# EAGLE schematic leer2 (EAGLE 6.5.0)
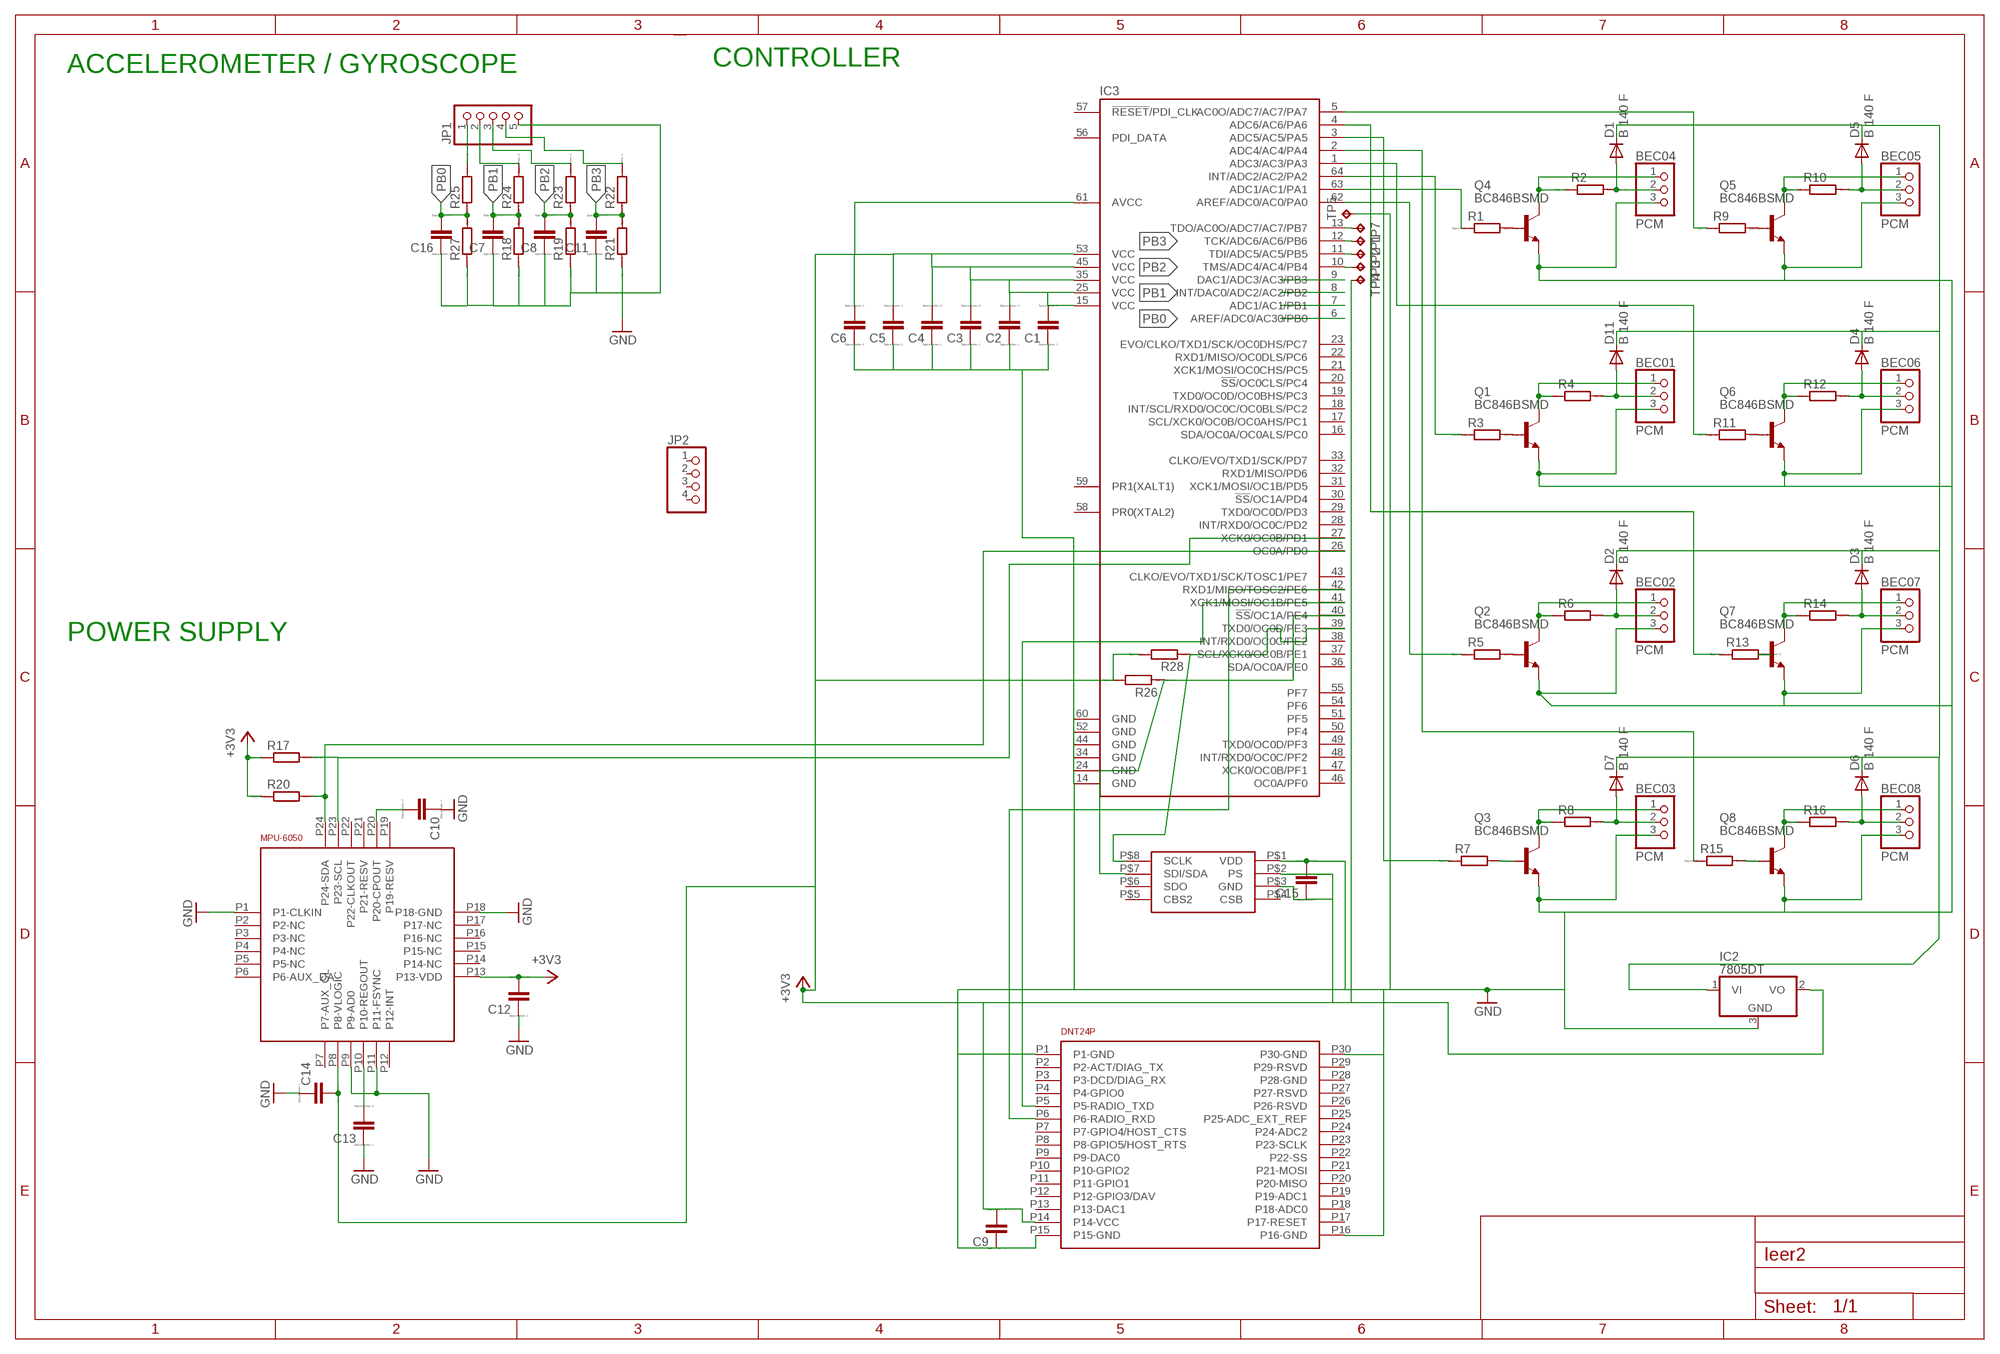
[diagram p0: schematic, sheet 1]

## Parts
BEC01  PCM  PINHD-1X3  [1X03]
BEC02  PCM  PINHD-1X3  [1X03]
BEC03  PCM  PINHD-1X3  [1X03]
BEC04  PCM  PINHD-1X3  [1X03]
BEC05  PCM  PINHD-1X3  [1X03]
BEC06  PCM  PINHD-1X3  [1X03]
BEC07  PCM  PINHD-1X3  [1X03]
BEC08  PCM  PINHD-1X3  [1X03]
C1  CC0603  [C0603]
C2  CC0603  [C0603]
C3  CC0603  [C0603]
C4  CC0603  [C0603]
C5  CC0603  [C0603]
C6  CC0603  [C0603]
C7  CC0603  [C0603]
C8  CC0603  [C0603]
C9  CC0603  [C0603]
C10  CC0603  [C0603]
C11  CC0603  [C0603]
C12  CC0603  [C0603]
C13  CC0603  [C0603]
C14  CC0603  [C0603]
C15  CC0603  [C0603]
C16  CC0603  [C0603]
D1  B 140 F  CGRM4001-G  [SOD-123_MINI-SMA]
D2  B 140 F  CGRM4001-G  [SOD-123_MINI-SMA]
D3  B 140 F  CGRM4001-G  [SOD-123_MINI-SMA]
D4  B 140 F  CGRM4001-G  [SOD-123_MINI-SMA]
D5  B 140 F  CGRM4001-G  [SOD-123_MINI-SMA]
D6  B 140 F  CGRM4001-G  [SOD-123_MINI-SMA]
D7  B 140 F  CGRM4001-G  [SOD-123_MINI-SMA]
D11  B 140 F  CGRM4001-G  [SOD-123_MINI-SMA]
IC2  7805DT  [TO252]
IC3  ATXMEGA##A3-64A  [TQFP-64]
JP1  PINHD-1X5/90  [1X05/90]
JP2  PINHD-1X4/90  [1X04/90]
Q1  BC846BSMD  [SOT23]
Q2  BC846BSMD  [SOT23]
Q3  BC846BSMD  [SOT23]
Q4  BC846BSMD  [SOT23]
Q5  BC846BSMD  [SOT23]
Q6  BC846BSMD  [SOT23]
Q7  BC846BSMD  [SOT23]
Q8  BC846BSMD  [SOT23]
R1  RR0603  [R0603]
R2  RR0603  [R0603]
R3  RR0603  [R0603]
R4  RR0603  [R0603]
R5  RR0603  [R0603]
R6  RR0603  [R0603]
R7  RR0603  [R0603]
R8  RR0603  [R0603]
R9  RR0603  [R0603]
R10  RR0603  [R0603]
R11  RR0603  [R0603]
R12  RR0603  [R0603]
R13  RR0603  [R0603]
R14  RR0603  [R0603]
R15  RR0603  [R0603]
R16  RR0603  [R0603]
R17  RR0603  [R0603]
R18  RR0603  [R0603]
R19  RR0603  [R0603]
R20  RR0603  [R0603]
R21  RR0603  [R0603]
R22  RR0603  [R0603]
R23  RR0603  [R0603]
R24  RR0603  [R0603]
R25  RR0603  [R0603]
R26  RR0603  [R0603]
R27  RR0603  [R0603]
R28  RR0603  [R0603]
TP1  TPTP08R  [TP08R]
TP2  TPTP08R  [TP08R]
TP3  TPTP08R  [TP08R]
TP4  TPTP08R  [TP08R]
TP5  TPTP08R  [TP08R]
TP7  TPTP08R  [TP08R]
U$1  DNT24P_RADIO_MODULE  [DNT24P_RADIO_MODULE]
U$2  MS5611  [01BA03]
U$3  MPU-6050_ACC_GYRO  [MPU-6050_ACC_GYRO]

## Nets
+3V3: C1.2 C2.2 C3.2 C4.2 C5.2 C6.2 C9.2 C12.2 C14.2 C15.1 IC2.2(VO) IC3.15(VCC) IC3.25(VCC) IC3.35(VCC) IC3.45(VCC) IC3.53(VCC) IC3.61(AVCC) R17.1 R20.1 R26.2 R28.2 TP4.TP U$1.P14(P14-VCC) U$2.P$2(PS) U$2.P$3(GND) U$3.P8(P8-VLOGIC) U$3.P13(P13-VDD)
GND: BEC01.3 BEC02.3 BEC03.3 BEC04.3 BEC05.3 BEC06.3 BEC07.3 BEC08.3 C1.1 C2.1 C3.1 C4.1 C5.1 C6.1 C7.1 C8.1 C9.1 C10.1 C11.1 C12.1 C13.1 C14.1 C15.2 C16.1 IC2.3(GND) IC3.14(GND) IC3.24(GND) IC3.34(GND) IC3.44(GND) IC3.52(GND) IC3.60(GND) JP1.5 Q1.2(E) Q2.2(E) Q3.2(E) Q4.2(E) Q5.2(E) Q6.2(E) Q7.2(E) Q8.2(E) R18.1 R19.1 R21.1 R27.1 TP5.TP U$1.P1(P1-GND) U$1.P15(P15-GND) U$1.P16(P16-GND) U$1.P30(P30-GND) U$2.P$1(VDD) U$3.P1(P1-CLKIN) U$3.P9(P9-AD0) U$3.P11(P11-FSYNC) U$3.P18(P18-GND)
N$1: Q4.1(B) R1.2
N$2: BEC01.1 Q1.3(C) R4.1
N$3: BEC01.2 D11.A R4.2
N$4: Q1.1(B) R3.2
N$5: BEC02.1 Q2.3(C) R6.1
N$6: BEC02.2 D2.A R6.2
N$7: Q2.1(B) R5.2
N$8: BEC03.1 Q3.3(C) R8.1
N$9: BEC03.2 D7.A R8.2
N$10: Q3.1(B) R7.2
N$11: BEC05.1 Q5.3(C) R10.1
N$12: BEC05.2 D5.A R10.2
N$13: Q5.1(B) R9.2
N$14: BEC04.1 Q4.3(C) R2.1
N$15: BEC04.2 D1.A R2.2
N$16: BEC06.1 Q6.3(C) R12.1
N$17: BEC06.2 D4.A R12.2
N$18: Q6.1(B) R11.2
N$19: BEC07.1 Q7.3(C) R14.1
N$20: BEC07.2 D3.A R14.2
N$21: Q7.1(B) R13.2
N$22: BEC08.1 Q8.3(C) R16.1
N$23: BEC08.2 D6.A R16.2
N$24: Q8.1(B) R15.2
N$25: IC3.63(ADC1/AC1/PA1) R1.1
N$26: IC3.64(INT/ADC2/AC2/PA2) R3.1
N$27: IC3.5(AC0O/ADC7/AC7/PA7) R9.1
N$28: IC3.4(ADC6/AC6/PA6) R13.1
N$29: IC3.62(AREF/ADC0/AC0/PA0) R5.1
N$30: IC3.1(ADC3/AC3/PA3) R11.1
N$31: IC3.2(ADC4/AC4/PA4) R15.1
N$32: IC3.3(ADC5/AC5/PA5) R7.1
N$33: IC3.41(XCK1/MOSI/OC1B/PE5) U$1.P5(P5-RADIO_TXD)
N$34: D1.C D2.C D3.C D4.C D5.C D6.C D7.C D11.C IC2.1(VI)
N$35: C10.2 U$3.P20(P20-CPOUT)
N$36: IC3.42(RXD1/MISO/TOSC2/PE6) U$1.P6(P6-RADIO_RXD)
N$37: C13.2 U$3.P10(P10-REGOUT)
N$38: IC3.10(TMS/ADC4/AC4/PB4) TP3.TP
N$39: IC3.11(TDI/ADC5/AC5/PB5) TP2.TP
N$40: IC3.12(TCK/ADC6/AC6/PB6) TP1.TP
N$41: IC3.13(TDO/AC0O/ADC7/AC7/PB7) TP7.TP
N$42: JP1.2 R24.2
N$43: JP1.3 R23.2
N$44: JP1.4 R22.2
N$46: IC3.39(TXD0/OC0D/PE3) R28.1 U$2.P$8(SCLK)
N$47: IC3.40(!SS!/OC1A/PE4) R26.1 U$2.P$7(SDI/SDA)
N$50: JP1.1 R25.2
PB0: C16.2 IC3.6(AREF/ADC0/AC30/PB0) R25.1 R27.2
PB1: C7.2 IC3.7(ADC1/AC1/PB1) R18.2 R24.1
PB2: C8.2 IC3.8(INT/DAC0/ADC2/AC2/PB2) R19.2 R23.1
PB3: C11.2 IC3.9(DAC1/ADC3/AC3/PB3) R21.2 R22.1
PF0: IC3.26(OC0A/PD0) R20.2 U$3.P24(P24-SDA)
PF1: IC3.27(XCK0/OC0B/PD1) R17.2 U$3.P23(P23-SCL)
Unconnected: IC3.16(SDA/OC0A/OC0ALS/PC0) IC3.17(SCL/XCK0/OC0B/OC0AHS/PC1) IC3.18(INT/SCL/RXD0/OC0C/OC0BLS/PC2) IC3.19(TXD0/OC0D/OC0BHS/PC3) IC3.20(!SS!/OC0CLS/PC4) IC3.21(XCK1/MOSI/OC0CHS/PC5) IC3.22(RXD1/MISO/OC0DLS/PC6) IC3.23(EVO/CLKO/TXD1/SCK/OC0DHS/PC7) IC3.28(INT/RXD0/OC0C/PD2) IC3.29(TXD0/OC0D/PD3) IC3.30(!SS!/OC1A/PD4) IC3.31(XCK1/MOSI/OC1B/PD5) IC3.32(RXD1/MISO/PD6) IC3.33(CLKO/EVO/TXD1/SCK/PD7) IC3.36(SDA/OC0A/PE0) IC3.37(SCL/XCK0/OC0B/PE1) IC3.38(INT/RXD0/OC0C/PE2) IC3.43(CLKO/EVO/TXD1/SCK/TOSC1/PE7) IC3.46(OC0A/PF0) IC3.47(XCK0/OC0B/PF1) IC3.48(INT/RXD0/OC0C/PF2) IC3.49(TXD0/OC0D/PF3) IC3.50(PF4) IC3.51(PF5) IC3.54(PF6) IC3.55(PF7) IC3.56(PDI_DATA) IC3.57(!RESET!/PDI_CLK) IC3.58(PR0(XTAL2)) IC3.59(PR1(XALT1)) JP2.1 JP2.2 JP2.3 JP2.4 U$1.P2(P2-ACT/DIAG_TX) U$1.P3(P3-DCD/DIAG_RX) U$1.P4(P4-GPIO0) U$1.P7(P7-GPIO4/HOST_CTS) U$1.P8(P8-GPIO5/HOST_RTS) U$1.P9(P9-DAC0) U$1.P10(P10-GPIO2) U$1.P11(P11-GPIO1) U$1.P12(P12-GPIO3/DAV) U$1.P13(P13-DAC1) U$1.P17(P17-RESET) U$1.P18(P18-ADC0) U$1.P19(P19-ADC1) U$1.P20(P20-MISO) U$1.P21(P21-MOSI) U$1.P22(P22-SS) U$1.P23(P23-SCLK) U$1.P24(P24-ADC2) U$1.P25(P25-ADC_EXT_REF) U$1.P26(P26-RSVD) U$1.P27(P27-RSVD) U$1.P28(P28-GND) U$1.P29(P29-RSVD) U$2.P$4(CSB) U$2.P$5(CBS2) U$2.P$6(SDO) U$3.P2(P2-NC) U$3.P3(P3-NC) U$3.P4(P4-NC) U$3.P5(P5-NC) U$3.P6(P6-AUX_DA) U$3.P7(P7-AUX_CL) U$3.P12(P12-INT) U$3.P14(P14-NC) U$3.P15(P15-NC) U$3.P16(P16-NC) U$3.P17(P17-NC) U$3.P19(P19-RESV) U$3.P21(P21-RESV) U$3.P22(P22-CLKOUT)

## Notes on the sheet
- ACCELEROMETER / GYROSCOPE | CONTROLLER
- POWER SUPPLY

## Library data of the parts
BEC01-BEC08 = pinhead:PINHD-1X3: PIN HEADER
C1-C16 = eagle-ltspice:C: CAPACITOR, European symbol; SPICEMODEL: NONE; SPICEPREFIX: C
D1-D7 D11 = diode:CGRM400*-G: Molded plasitc,JEDEC SOD-123/Mini SMA Source: Comchip CGRM4001-G.pdf
IC2 = linear:78*: Positive VOLTAGE REGULATOR Source: http://cache.national.com/ds/LM/LM78L05.pdf http://www.fairchildsemi.com/ds/LM/LM7805.pdf
IC3 = ATxmega__A3:ATXMEGA##A3
JP1 = pinhead:PINHD-1X5: PIN HEADER
JP2 = pinhead:PINHD-1X4: PIN HEADER
Q1-Q8 = transistor-npn:BC846*: NPN Transistor
R1-R28 = eagle-ltspice:R: RESISTOR, European symbol; SPICEMODEL: NONE; SPICEPREFIX: R
TP1-TP5 TP7 = testpad:TP: Test pad
U$1 = USER PARTS:DNT24P_RADIO_MODULE
U$2 = ms5611:MS5611
U$3 = USER PARTS:MPU-6050_ACC_GYRO